# Altium schematic sheet Schem_Amp_Valvulado 2.0.SchDoc
size A4
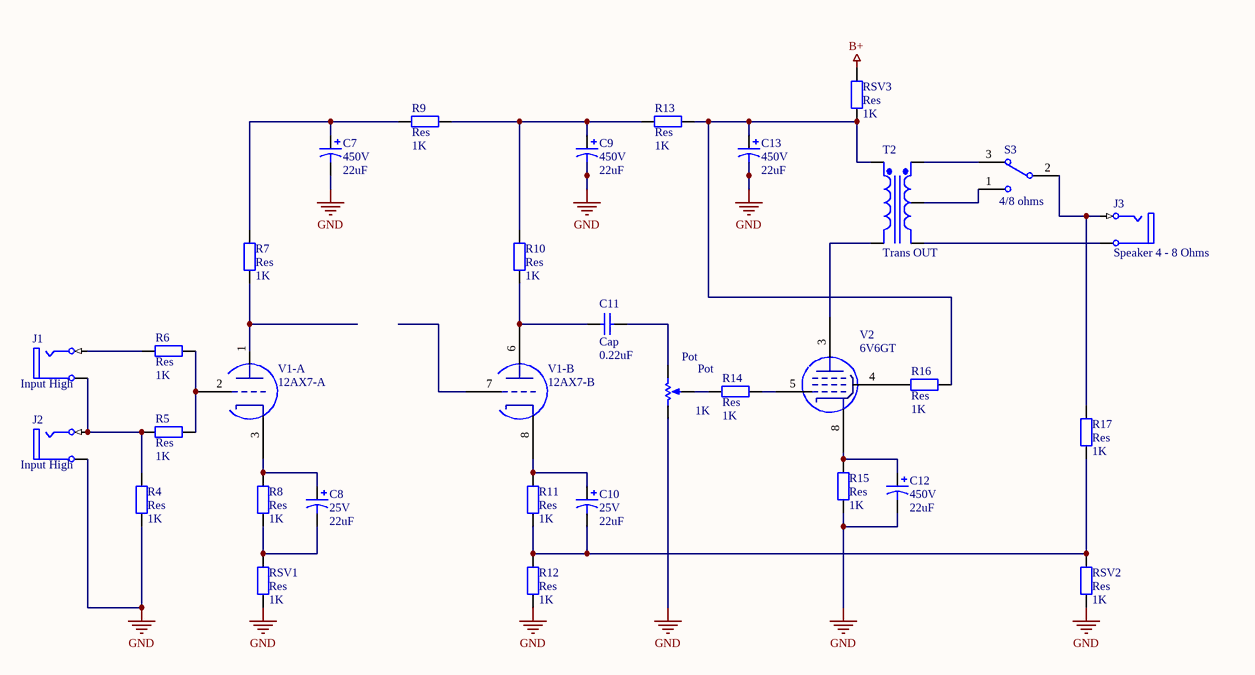
[diagram p0: Schem_Amp_Valvulado 2.0.SchDoc]

## Parts
C7  450V  value 22uF  [Cap7.6-15]
C8  25V  value 22uF  [CAP Pol.254]
C9  450V  value 22uF  [Cap7.6-15]
C10  25V  value 22uF  [CAP Pol.254]
C11  Cap  value 0.22uF  [RAD-0.3]
C12  450V  value 22uF  [Cap7.6-15]
C13  450V  value 22uF  [Cap7.6-15]
J1  Input High  [JACK/6-V2]
J2  Input High  [JACK/6-V2]
J3  Speaker 4 - 8 Ohms  [JACK/6-V2]
Pot  Pot  value 1K  [Header 3-pin]
R4  Res  value 1K  [AXIAL-0.5]
R5  Res  value 1K  [AXIAL-0.5]
R6  Res  value 1K  [AXIAL-0.5]
R7  Res  value 1K  [AXIAL-0.5]
R8  Res  value 1K  [AXIAL-0.5]
R9  Res  value 1K  [AXIAL-0.5]
R10  Res  value 1K  [AXIAL-0.5]
R11  Res  value 1K  [AXIAL-0.5]
R12  Res  value 1K  [AXIAL-0.5]
R13  Res  value 1K  [AXIAL-0.5]
R14  Res  value 1K  [AXIAL-0.5]
R15  Res  value 1K  [AXIAL-0.5]
R16  Res  value 1K  [AXIAL-0.5]
R17  Res  value 1K  [AXIAL-0.5]
RSV1  Res  value 1K  [AXIAL-0.5]
RSV2  Res  value 1K  [AXIAL-0.5]
RSV3  Res  value 1K  [AXIAL-0.5]
S3  4/8 ohms  [TL36WW15050]
T2  Trans OUT  [TRF_5]
V1-A  12AX7-A
V1-B  12AX7-B
V2  6V6GT

## Nets
B+: RSV3.1
GND: C7.2 C9.2 C12.2 C13.2 J2.5(S) Pot.3(BOT) R4.2 R12.1 R15.1 RSV1.1 RSV2.1
NetC7_1: C7.1 R7.2 R9.2
NetC8_1: C8.1 R8.2 V1-A.3(Cathode)
NetC8_2: C8.2 R8.1 RSV1.2
NetC9_1: C9.1 R9.1 R10.2 R13.2
NetC10_1: C10.1 R11.2 V1-B.8(Cathode)
NetC10_2: C10.2 R11.1 R12.2 R17.1 RSV2.2
NetC11_1: C11.1 R10.1 V1-B.6(Plate)
NetC11_2: C11.2 Pot.1(TOP)
NetC12_1: C12.1 R15.2 V2.8(Cathode)
NetC13_1: C13.1 R13.1 R16.1 RSV3.2 T2.1(Pri+)
NetJ1_1: J1.1(T) R6.2
NetJ1_5: J1.5(S) J2.1(T) R4.1 R5.2
NetJ3_1: J3.1(T) R17.2 S3.2
NetJ3_5: J3.5(S) T2.5(Sec-)
NetPot_2: Pot.2(TAP) R14.2
NetR5_1: R5.1 R6.1 V1-A.2(Grid)
NetR7_1: R7.1 V1-A.1(Plate)
NetR14_1: R14.1 V2.5(Grid)
NetR16_2: R16.2 V2.4(Supress)
NetS3_1: S3.1 T2.4(SecCT)
NetS3_3: S3.3 T2.3(Sec+)
NetT2_2: T2.2(Pri-) V2.3(Plate)

Not connected (* = marked no-connect by the designer): V1-B 7(Grid)

## Library data of the parts
C7-C10 C12 C13 = Cap Pol1: Polarized Capacitor (Radial); Published: 8-Jun-2000; LatestRevisionDate: 17-Jul-2002; LatestRevisionNote: Re-released for DXP Platform.; PackageReference: Cap7.6-15; Publisher: Altium Limited; PackageDescription: Polarized Capacitor (Radial); 2 Leads
C11 = Cap: Capacitor; Published: 8-Jun-2000; LatestRevisionDate: 17-Jul-2002; LatestRevisionNote: Re-released for DXP Platform.; PackageReference: RAD-0.3; Publisher: Altium Limited; PackageDescription: Radial Cap, Thru-Hole; 2 Leads; 0.3 in Pin Spacing
J1-J3 = Phonejack2: Jack Socket, 1/4" [6.5mm], Thru-Hole, Vertical, 2-Conductor Open Circuit; PackageDocument: 2003; PCB_Layout: Complies with manufacturer's recommendation.; DrillAndSlotSize: Corresponds to nominal value.; LatestRevisionDate: 15-Jul-2004; LatestRevisionNote: Component Replaced.; DatasheetDocument: 2003; PackageReference: S1VS_SNS; Publisher: Altium Limited; ComponentLink1Description: Manufacturer Link; ComponentLink1URL: http://www.cliffuk.co.uk/
Pot = Pot: Potentiometer; Sim Note: Enter the Resistance value and the set point into parameter fields.; Set Position: 0.5; Published: 8-Jun-2000; LatestRevisionDate: 17-Jul-2002; LatestRevisionNote: Re-released for DXP Platform.; PackageReference: VR5; Publisher: Altium Limited; PackageDescription: Variable Resistor, Thru-Hole; 3 Leads
R4-R17 RSV1-RSV3 = Res: Resistor; Published: 8-Jun-2000; LatestRevisionDate: 17-Jul-2002; LatestRevisionNote: Re-released for DXP Platform.; PackageReference: AXIAL-0.4; Publisher: Altium Limited; PackageDescription: Axial Device, Thru-Hole; 2 Leads; 0.4 in Pin Spacing
S3 = SW-SPDT: SPDT Subminiature Toggle Switch, Right Angle Mounting, Vertical Actuation; Published: 24-Mar-1999; LatestRevisionDate: 17-Dec-2003; LatestRevisionNote: Schematic revised, PCB Footprint replaced.; DatasheetVersion: 05-Dec-2000; PackageReference: TL36WW15050; Publisher: Altium Limited; PackageDescription: Switch; 4 Leads; ComponentLink1Description: Manufacturer Link; ComponentLink1URL: http://www.apem.com
T2 = Trans CT: Center-Tapped Transformer (Coupled Inductor Model); Referencia: TS 5 60.B; Marca: Schatz; Saida (ohms): 4/8; Entrada (ohms): 8000; Published: 8-Jun-2000; LatestRevisionDate: 17-Jul-2002; LatestRevisionNote: Re-released for DXP Platform.; PackageReference: TRF_5; Publisher: Altium Limited; PackageDescription: Transformer; 5 Leads